# Altium schematic sheet STC89C52.SchDoc
size A4
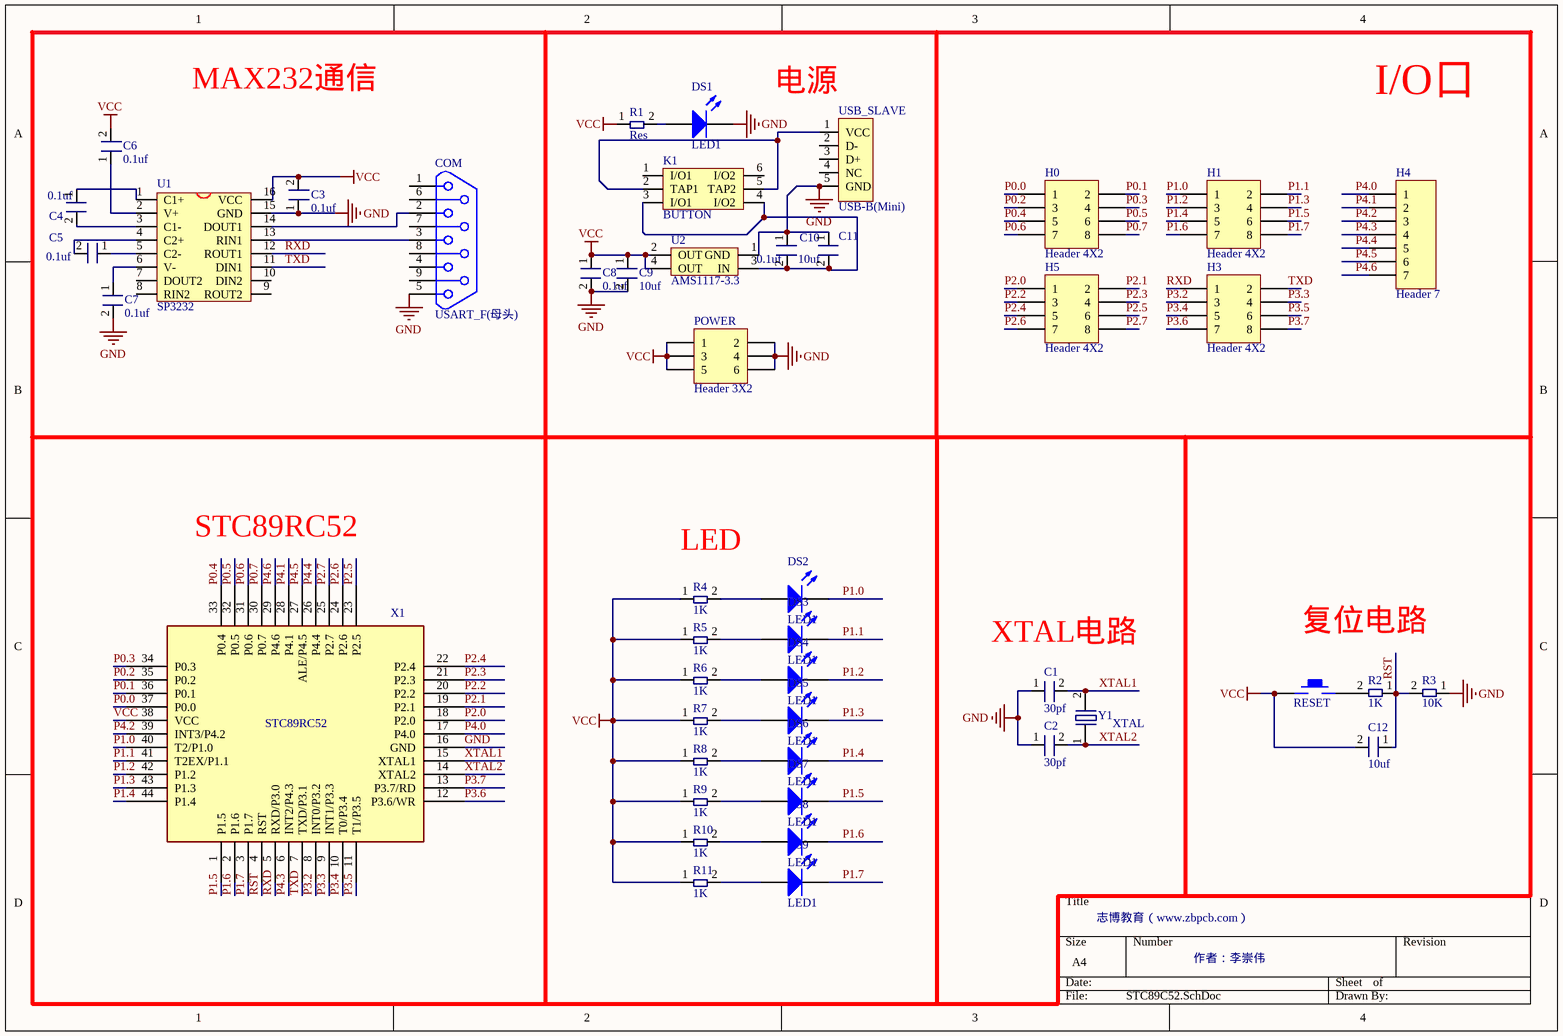
[diagram p0: STC89C52.SchDoc]

## Parts
C1  30pf  [Cap]
C2  30pf  [Cap]
C3  0.1uf  [Cap]
C4  0.1uf  [Cap]
C5  0.1uf  [Cap]
C6  0.1uf  [Cap]
C7  0.1uf  [Cap]
C8  0.1uf  [Cap]
C9  10uf  [Cap]
C10  0.1uf  [Cap]
C11  10uf  [Cap]
C12  10uf  [Cap]
COM  USART_F(母头)  [DB9]
DS1  LED1  [SMDLED]
DS2  LED1  [SMDLED]
DS3  LED1  [SMDLED]
DS4  LED1  [SMDLED]
DS5  LED1  [SMDLED]
DS6  LED1  [SMDLED]
DS7  LED1  [SMDLED]
DS8  LED1  [SMDLED]
DS9  LED1  [SMDLED]
H0  Header 4X2  [HDR2X4]
H1  Header 4X2  [HDR2X4]
H3  Header 4X2  [HDR2X4]
H4  Header 7  [HDR1X7]
H5  Header 4X2  [HDR2X4]
K1  BUTTON  [BTN8.5*8.5]
POWER  Header 3X2  [HDR2X3]
R1  Res  [Cap]
R2  1K  [Cap]
R3  10K  [Cap]
R4  1K  [Cap]
R5  1K  [Cap]
R6  1K  [Cap]
R7  1K  [Cap]
R8  1K  [Cap]
R9  1K  [Cap]
R10  1K  [Cap]
R11  1K  [Cap]
RESET  KEY_M  [KEY_M]  (value not drawn)
U1  SP3232  [SOP16M]
U2  AMS1117-3.3  [AMS1117]
USB_SLAVE  USB-B(Mini)  [USB/SM0.8-6H5]
X1  STC89RC52  [STC89C52]
Y1  XTAL  [XTAL]

## Nets
GND: C1.1 C2.1 C3.1 C7.2 C8.2 C9.2 C10.1 C11.1 COM.5 DS1.2(K) POWER.2 POWER.4 POWER.6 R3.1 U1.15(GND) U2.1(GND) USB_SLAVE.5(GND) X1.16(GND)
VCC: C3.2 C6.2 C8.1 C9.1 C12.2 POWER.1 POWER.3 POWER.5 R1.1 R4.1 R5.1 R6.1 R7.1 R8.1 R9.1 R10.1 R11.1 RESET.1 U1.16(VCC) U2.2(OUT) U2.4(OUT) X1.38(VCC)
P0.0: H0.1 X1.37(P0.0)
P0.1: H0.2 X1.36(P0.1)
P0.2: H0.3 X1.35(P0.2)
P0.3: H0.4 X1.34(P0.3)
P0.4: H0.5 X1.33(P0.4)
P0.5: H0.6 X1.32(P0.5)
P0.6: H0.7 X1.31(P0.6)
P0.7: H0.8 X1.30(P0.7)
P1.0: DS2.2(K) H1.1 X1.40(T2/P1.0)
P1.1: DS3.2(K) H1.2 X1.41(T2EX/P1.1)
P1.2: DS4.2(K) H1.3 X1.42(P1.2)
P1.3: DS5.2(K) H1.4 X1.43(P1.3)
P1.4: DS6.2(K) H1.5 X1.44(P1.4)
P1.5: DS7.2(K) H1.6 X1.1(P1.5)
P1.6: DS8.2(K) H1.7 X1.2(P1.6)
P1.7: DS9.2(K) H1.8 X1.3(P1.7)
P2.0: H5.1 X1.18(P2.0)
P2.1: H5.2 X1.19(P2.1)
P2.2: H5.3 X1.20(P2.2)
P2.3: H5.4 X1.21(P2.3)
P2.4: H5.5 X1.22(P2.4)
P2.5: H5.6 X1.23(P2.5)
P2.6: H5.7 X1.24(P2.6)
P2.7: H5.8 X1.25(P2.7)
P3.2: H3.3 X1.8(INT0/P3.2)
P3.3: H3.4 X1.9(INT1/P3.3)
P3.4: H3.5 X1.10(T0/P3.4)
P3.5: H3.6 X1.11(T1/P3.5)
P3.6: H3.7 X1.12(P3.6/WR)
P3.7: H3.8 X1.13(P3.7/RD)
P4.0: H4.1 X1.17(P4.0)
P4.1: H4.2 X1.28(P4.1)
P4.2: H4.3 X1.39(INT3/P4.2)
P4.3: H4.4 X1.6(INT2/P4.3)
P4.4: H4.5 X1.26(P4.4)
P4.5: H4.6 X1.27(ALE/P4.5)
P4.6: H4.7 X1.29(P4.6)
RST: C12.1 R2.1 R3.2 X1.4(RST)
RXD: H3.1 U1.12(ROUT1) X1.5(RXD/P3.0)
TXD: H3.2 U1.11(DIN1) X1.7(TXD/P3.1)
XTAL1: C1.2 X1.15(XTAL1) Y1.2
XTAL2: C2.2 X1.14(XTAL2) Y1.1
NetC4_1: C4.1 U1.1(C1+)
NetC4_2: C4.2 U1.3(C1-)
NetC5_1: C5.1 U1.5(C2-)
NetC5_2: C5.2 U1.4(C2+)
NetC6_1: C6.1 U1.2(V+)
NetC7_1: C7.1 U1.6(V-)
NetC10_2: C10.2 C11.2 K1.3(I/O1) K1.4(I/O2) U2.3(IN)
NetCOM_2: COM.2 U1.14(DOUT1)
NetCOM_3: COM.3 U1.13(RIN1)
NetDS1_1: DS1.1(A) R1.2
NetDS2_1: DS2.1(A) R4.2
NetDS3_1: DS3.1(A) R5.2
NetDS4_1: DS4.1(A) R6.2
NetDS5_1: DS5.1(A) R7.2
NetDS6_1: DS6.1(A) R8.2
NetDS7_1: DS7.1(A) R9.2
NetDS8_1: DS8.1(A) R10.2
NetDS9_1: DS9.1(A) R11.2
NetK1_2: K1.2(TAP1) K1.5(TAP2) USB_SLAVE.1(VCC)
NetR2_2: R2.2 RESET.2

Not connected (* = marked no-connect by the designer): COM 1 4 6 7 8 9; K1 1(I/O1) 6(I/O2); U1 7(DOUT2) 8(RIN2) 9(ROUT2) 10(DIN2); USB_SLAVE 2(D-) 3(D+) 4(NC)

## Notes on the sheet
- MAX232通信
- (near USB_SLAVE) 电源
- I/O口
- STC89RC52
- (near R4) LED
- XTAL电路
- 复位电路
- 志博教育（www.zbpcb.com）
- 作者：李崇伟

## Library data of the parts
C1-C12 = Cap
COM = DB9
DS1-DS9 = LED2: Typical RED, GREEN, YELLOW, AMBER GaAs LED; Published: 8-Jun-2000; LatestRevisionDate: 17-Jul-2002; LatestRevisionNote: Re-released for DXP Platform.; PackageDocument: Feb-2002; PackageReference: 3.2X1.6X1.1; Publisher: Altium Limited
H0 H1 H3 H5 = Header 4X2: Header, 4-Pin, Dual row; LatestRevisionDate: 17-Jul-2002; LatestRevisionNote: Re-released for DXP Platform.; Publisher: Altium Limited
H4 = Header 7: Header, 7-Pin; LatestRevisionDate: 17-Jul-2002; LatestRevisionNote: Re-released for DXP Platform.; Publisher: Altium Limited
POWER = Header 3X2: Header, 3-Pin, Dual row; LatestRevisionDate: 17-Jul-2002; LatestRevisionNote: Re-released for DXP Platform.; Publisher: Altium Limited
R2-R11 = Res
U1 = MAX3232
U2 = AMS1117
USB_SLAVE = USB5